# Altium schematic sheet Integirane_komponente.SchDoc
size A4
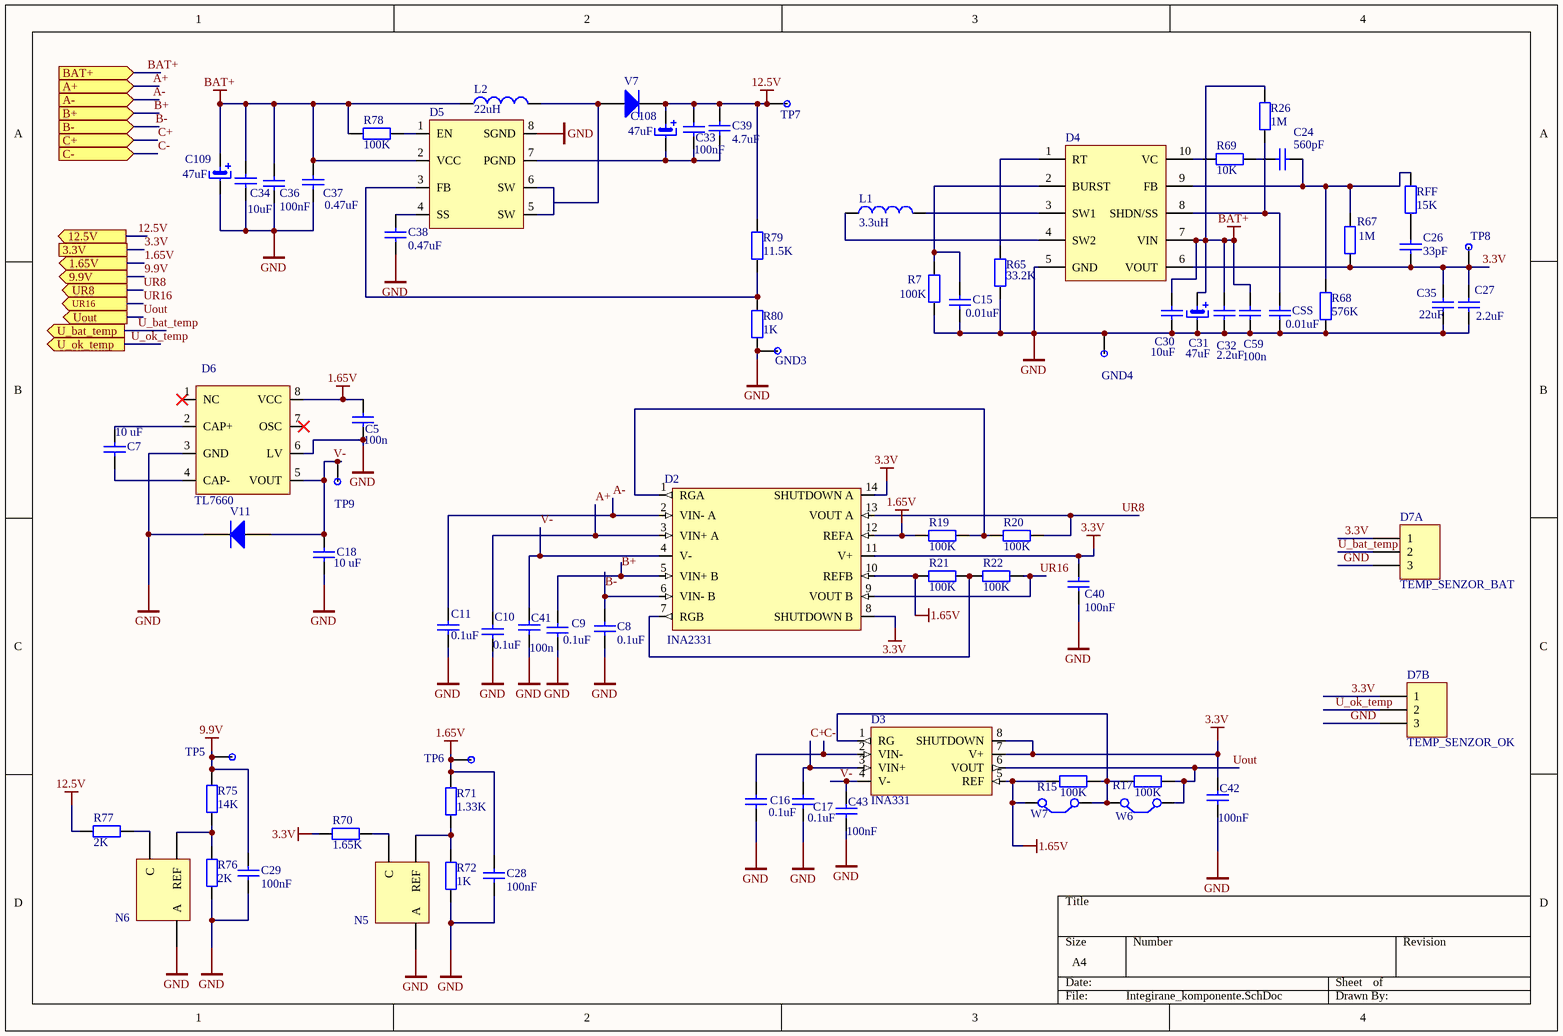
[diagram p0: Integirane_komponente.SchDoc]

## Parts
C5  100n  [C0805]
C7  10 uF  [C1210_L]
C8  0.1uF  [C1210_L]
C9  0.1uF  [C1210_L]
C10  0.1uF  [C1210_L]
C11  0.1uF  [C1210_L]
C15  0.01uF  [CAP_0603]
C16  0.1uF  [C1210_L]
C17  0.1uF  [C1210_L]
C18  10 uF  [C1210_L]
C24  560pF  [C0805]
C26  33pF  [0402]
C27  2.2uF  [C1210_L]
C28  100nF  [C0805]
C29  100nF  [C0805]
C30  10uF  [C1210_L]
C31  47uF  [SMD_CAP_RAD_8X10.2]
C32  2.2uF  [C1210_L]
C33  100nF  [C0805]
C34  10uF  [C1210_L]
C35  22uF  [C0805]
C36  100nF  [C0805]
C37  0.47uF  [C1210_L]
C38  0.47uF  [C1210_L]
C39  4.7uF  [C0805]
C40  100nF  [C0805]
C41  100n  [C0805]
C42  100nF  [C0805]
C43  100nF  [C0805]
C59  100n  [C0805]
C108  47uF  [SMD_CAP_RAD_8X10.2]
C109  47uF  [SMD_CAP_RAD_8X10.2]
CSS  0.01uF  [CAP_0603]
D2  INA2331  [F za pojacalo(2)]
D3  INA331  [F za pojačalo (1)]
D4  LTC3530EMS#PBF  [MSOP10]  (value not drawn)
D5  APE1911-HF-3  [ESOP8_12.5V]  (value not drawn)
D6  TL7660  [invertor]
D7A  TEMP_SENZOR_BAT  [temp_senzor]
D7B  TEMP_SENZOR_OK  [temp_senzor_datasheet]
GND3  *  (value not drawn)
GND4  *  (value not drawn)
L1  3.3uH  [inductor_3.3uH]
L2  22uH  [inductor_22uH]
N5  *  [SOT23_N5_N6]  (value not drawn)
N6  Voltage Reference  [SOT23_N5_N6]  (value not drawn)
R7  100K  [C0805]
R15  100K  [C0805]
R17  100K  [C0805]
R19  100K  [C0805]
R20  100K  [C0805]
R21  100K  [C0805]
R22  100K  [C0805]
R26  1M  [C1210_L]
R65  33.2K  [C1206]
R67  1M  [C1210_L]
R68  576K  [C1206]
R69  10K  [C0805]
R70  1.65K  [C0805]
R71  1.33K  [C0805]
R72  1K  [C1206]
R75  14K  [C1206]
R76  2K  [C1206]
R77  2K  [C1206]
R78  100K  [C0805]
R79  11.5K  [C0805]
R80  1K  [C1206]
RFF  15K  [C1206]
TP5  *  (value not drawn)
TP6  *  (value not drawn)
TP7  *  (value not drawn)
TP8  *  (value not drawn)
TP9  *  (value not drawn)
V7  B340A-13-F  [DO-214AC]  (value not drawn)
V11  Diode  [Diode -small signal]  (value not drawn)
W6  Jumper  [HDR1X2]  (value not drawn)
W7  Jumper  [HDR1X2]  (value not drawn)

## Ports
1.65V (out), 3.3V, 9.9V (out), 12.5V (out), A+ (in), A- (in), B+ (in), B- (in), BAT+ (in), C+ (in), C- (in), U_bat_temp (out), U_ok_temp (out), Uout (out), UR8 (out), UR16 (out)

## Nets
1.65V: C5.2 C28.1 D2.10(REFB) D2.12(REFA) D3.5(REF) D6.8(VCC) R15.2 R19.2 R21.2 R71.2 TP6.1 W7.2(C2) ; port 1.65V
3.3V: C26.2 C27.1 C35.1 C40.2 C42.2 D2.8(SHUTDOWN_B) D2.11(V+) D2.14(SHUTDOWN_A) D3.7(V+) D3.8(SHUTDOWN) D4.6(VOUT) D7A.1 D7B.1 R67.2 R70.1 TP8.1 ; port 3.3V
9.9V: C29.1 R75.2 TP5.1 ; port 9.9V
12.5V: C33.2 C39.2 C108.1 R77.2 R79.2 TP7.1 V7.2(K) ; port 12.5V
BAT+: C30.2 C31.1 C32.1 C34.2 C36.2 C37.2 C59.2 C109.1 D4.7(VIN) D5.2(VCC) L2.1 R26.1 R78.1 ; port BAT+
GND: C5.1 C8.1 C9.1 C10.1 C11.1 C15.1 C16.1 C17.1 C18.1 C27.2 C28.2 C29.2 C30.1 C31.2 C32.2 C34.1 C35.2 C36.1 C37.1 C38.1 C40.1 C41.1 C42.1 C43.1 C59.1 C109.2 CSS.1 D4.5(GND) D5.8(SGND) D6.3(GND) D6.6(LV) D7A.3 D7B.3 GND3.1 GND4.1 N5.3(A) N6.3(A) R7.1 R65.1 R68.2 R72.1 R76.1 R80.1 V11.2(K)
A+: C10.2 D2.3(VIN+_A) ; port A+
A-: C11.2 D2.2(VIN-_A) ; port A-
B+: C9.2 D2.5(VIN+_B) ; port B+
B-: C8.2 D2.6(VIN-_B) ; port B-
C+: C17.2 D3.3(VIN+) ; port C+
C-: C16.2 D3.2(VIN-) ; port C-
U_bat_temp: D7A.2 ; port U_bat_temp
U_ok_temp: D7B.2 ; port U_ok_temp
Uout: D3.6(VOUT) R17.1 W6.1(C1) ; port Uout
UR8: D2.13(VOUT_A) R20.1 ; port UR8
UR16: D2.9(VOUT_B) R22.1 ; port UR16
V-: C18.2 C41.2 C43.2 D2.4(V-) D3.4(V-) D6.5(VOUT) TP9.1 V11.1(A)
NetC7_1: C7.1 D6.4(CAP-)
NetC7_2: C7.2 D6.2(CAP+)
NetC15_2: C15.2 D4.2(BURST) R7.2
NetC24_1: C24.1 D4.9(FB) R67.1 R68.1 RFF.2
NetC24_2: C24.2 R69.1
NetC26_1: C26.1 RFF.1
NetC33_1: C33.1 C39.1 C108.2 D5.7(PGND)
NetC38_2: C38.2 D5.4(SS)
NetCSS_2: CSS.2 D4.8(SHDN/SS) R26.2
NetD2_1: D2.1(RGA) R19.1 R20.2
NetD2_7: D2.7(RGB) R21.1 R22.2
NetD3_1: D3.1(RG) R15.1 R17.2 W6.2(C2) W7.1(C1)
NetD4_1: D4.1(RT) R65.2
NetD4_3: D4.3(SW1) L1.2
NetD4_4: D4.4(SW2) L1.1
NetD4_10: D4.10(VC) R69.2
NetD5_1: D5.1(EN) R78.2
NetD5_3: D5.3(FB) R79.1 R80.2
NetD5_5: D5.5(SW) D5.6(SW)
NetL2_2: L2.2 V7.1(A)
NetN5_1: N5.1(REF) R71.1 R72.2
NetN5_2: N5.2(C) R70.2
NetN6_1: N6.1(REF) R75.1 R76.2
NetN6_2: N6.2(C) R77.1

Not connected (* = marked no-connect by the designer): D6 1(NC)* 7(OSC)*

## Library data of the parts
C5 C41 C59 = Cap: Capacitor; Value: 100nF; cijena (funte): 0.141; dobavljač: Farnell; kataloški broj: 1856515; opis komponente: Capacitor 100nF
C7 C18 = Cap: Capacitor; dobavljač: Farnell; kataloški broj: 2320934; cijena (funte): 0.275; opis komponente: Ceramic Capacitor; Value: 10 uF
C8-C11 C16 C17 = Cap: Capacitor; Value: 100nF; dobavljač: Farnell; kataloški broj: 1828960; cijena (funte): 0.241; opis komponente: Capacitor
C15 CSS = Cap: Capacitor; cijena (funte): 0.0529; dobavljač: Farnell; kataloški broj: 1709948; opis komponente: Capacitor 0.01uF; Value: 0.01uF
C24 = Cap: Capacitor; cijena (funte): 0.127; dobavljač: Farnell; kataloški broj: 2332776; opis komponente: Capacitor 560pF; Value: 560pF
C26 = Cap: Capacitor; cijena (funte): 0.0496; dobavljač: Farnell; kataloški broj: 2821128; opis komponente: Capacitor 33pF; Value: 33pF
C27 = Cap: Capacitor; Value: 100pF; cijena (funte): 0.539; dobavljač: Farnell; kataloški broj: 2688549; opis komponente: ceramic capacitor
C28 C29 C33 C36 C40 C42 C43 = Cap: Capacitor; cijena (funte): 0.141; dobavljač: Farnell; kataloški broj: 1856515; opis komponente: Capacitor 100nF; Value: 100nF
C30 = Cap: Capacitor; dobavljač: Farnell; kataloški broj: 2320931; Value: 10 uF; cijena (funte): -; opis komponente: Capacitor
C31 C108 C109 = elko: cijena (funte): 0.619; dobavljač: Farnell; kataloški broj: 9696032; opis komponente: Electrolytic Capacitor; Value: 47uF
C32 = Cap: Capacitor; Value: 100pF; cijena (funte): 0.539; dobavljač: Farnell; kataloški broj: 2688549; opis komponente: Ceramic Capacitor
C34 = Cap: Capacitor; dobavljač: Farnell; kataloški broj: 2320931; opis komponente: Capacitor 100nF; Value: 10uF; cijena (funte): -
C35 = Cap: Capacitor; cijena (funte): 0.31; dobavljač: Farnell; kataloški broj: 2672185; opis komponente: Ceramic Capacitor; Value: 22uF
C37 C38 = Cap: Capacitor; cijena (funte): 0.302; dobavljač: Farnell; kataloški broj: 2320942; opis komponente: Capacitor 0.47uF; Value: 0.47uF
C39 = Cap: Capacitor; cijena (funte): 0.61; dobavljač: Farnell; kataloški broj: 2346932; opis komponente: Capacitor 4.7uF; Value: 4.7uF
D2 = pojačalo(2): cijena (funte): 2.95; dobavljač: Farnell; kataloški broj: 2496201; opis komponente: pojačalo
D3 = pojačalo (1): cijena (funte): 2.63; dobavljač: Farnell; kataloški broj: 1459472; opis komponente: INA331
D4 = LTC3530EMS#PBF: cijena (funte): 4.41; dobavljač: Farnell; kataloški broj: 1329368; opis komponente: LTC3530EMS#PBF
D5 = APE1911-HF-3: cijena (funte): 0.371; dobavljač: Farnell; kataloški broj: 2319645; opis komponente: Boost(Step Up) Regulator 12.5V
D6 = invertor: cijena (funte): 1.32; dobavljač: Farnell; kataloški broj: 1755282; opis komponente: invertor
D7A D7B = Header 3: Header, 3-Pin; cijena (funte): 0.516; dobavljač: Farnell; kataloški broj: 2432144; opis komponente: temp_senzor
GND3 GND4 TP5-TP9 = testpoint
L1 = Inductor: cijena (funte): 0.295; dobavljač: Farnell; kataloški broj: 2808289; opis komponente: zavojnica 3.3uH; Value: 3.3uH
L2 = Inductor: cijena (funte): 0.412; dobavljač: Farnell; kataloški broj: 2061654; opis komponente: Inductor 22uH; Value: 22uH
N5 = voltage_ref: cijena (funte): 0.299; dobavljač: Farnell; kataloški broj: 1904053; opis komponente: Voltage Reference 1.65V; Value: 1.65V
N6 = voltage_ref: cijena (funte): 0.299; dobavljač: Farnell; kataloški broj: 1904053; opis komponente: Voltage Reference 9.9V; Value: 9.9V
R7 R15 R17 R19-R22 R78 = Res2: Resistor; cijena (funte): 0.006; dobavljač: Farnell; kataloški broj: 2447551; opis komponente: Resistor 100K; Value: 100K
R26 = Res2: Resistor; cijena (funte): 0.206; dobavljač: Farnell; kataloški broj: 1153399; opis komponente: Resistor 1M; Value: 1M
R65 = Res2: Resistor; cijena (funte): 0.0253; dobavljač: Farnell; kataloški broj: 1632568; opis komponente: resistor 33.2K; Value: 33.2K
R67 = Res2: Resistor; cijena (funte): 0.206; dobavljač: FArnell; kataloški broj: 1153399; opis komponente: Resistor 1M; Value: 1M
R68 = Res2: Resistor; cijena (funte): 0.0292; dobavljač: Farnell; kataloški broj: 2307780; opis komponente: otpornik; Value: 576K
R69 = Res2: Resistor; cijena (funte): 0.237; dobavljač: Farnell; kataloški broj: 1577673; opis komponente: Resistor 10K; Value: 10K
R70 = Res2: Resistor; dobavljač: Farnell; kataloški broj: 1160148; cijena (funte): 0.48; opis komponente: Resistor 1.65K; Value: 1.65K
R71 = Res2: Resistor; dobavljač: Farnell; kataloški broj: 1160148; cijena (funte): 0.48; opis komponente: Resistor 1.33K 0.1%; Value: 1.33K
R72 = Res2: Resistor; dobavljač: Farnell; kataloški broj: 1858213; cijena (funte): 1.08; opis komponente: Resistor 1K 0.1%; Value: 1K
R75 = Res2: Resistor; dobavljač: Farnell; kataloški broj: 1501725; cijena (funte): 0.60; opis komponente: Resistor 14K 0.1%; Value: 14K
R76 = Res2: Resistor; dobavljač: Farnell; kataloški broj: 1858216; cijena (funte): 0.929; opis komponente: Resistor 2K 0.1%; Value: 2K
R77 = Res2: Resistor; dobavljač: Farnell; kataloški broj: 1858216; cijena (funte): 0.929; opis komponente: Resistor 2K; Value: 2K
R79 = Res2: Resistor; cijena (funte): 0.27; dobavljač: Farnell; kataloški broj: 9369856; opis komponente: Resistor 11.5K 0.1%; Value: 11.5K
R80 = Res2: Resistor; cijena (funte): 1.08; dobavljač: Farnell; kataloški broj: 1858213; opis komponente: Resistor 1K  0.1%; Value: 1K
RFF = Res2: Resistor; cijena (funte): 0.023; dobavljač: Farnell; kataloški broj: 2079009; opis komponente: Resistor 15K; Value: 15K
V7 = Diode 1N4148: High Conductance Fast Diode; cijena (funte): 0.23; dobavljač: Farnell; kataloški broj: 2306401; opis komponente: Dioda (3A, 40V)
V11 = Diode 1N4148: High Conductance Fast Diode; cijena (funte): 0.237; dobavljač: Farnell; kataloški broj: 1773531; opis komponente: dioda
W6 W7 = Jumper: Jumper Wire; cijena (funte): 0.0874; dobavljač: Farnell; kataloški broj: 2396303; opis komponente: jumper